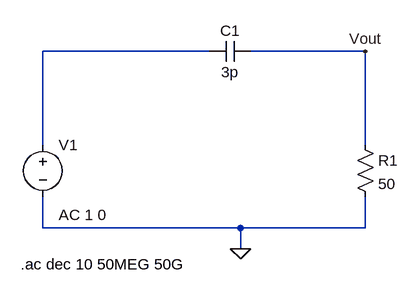
[diagram p0: schematic spice_example.asc]
spice_example.asc, the LTspice schematic file:
Version 4
SHEET 1 880 680
WIRE 240 -16 -16 -16
WIRE 480 -16 304 -16
WIRE -16 128 -16 -16
WIRE 480 128 480 -16
WIRE -16 256 -16 208
WIRE 288 256 -16 256
WIRE 480 256 480 208
WIRE 480 256 288 256
WIRE 288 288 288 256
FLAG 288 288 0
FLAG 480 -16 Vout
SYMBOL voltage -16 112 R0
WINDOW 3 24 96 Invisible 2
WINDOW 123 24 124 Left 2
WINDOW 39 0 0 Left 0
SYMATTR InstName V1
SYMATTR Value 0
SYMATTR Value2 AC 1 0
SYMBOL cap 304 -32 R90
WINDOW 0 0 32 VBottom 2
WINDOW 3 32 32 VTop 2
SYMATTR InstName C1
SYMATTR Value 3p
SYMBOL res 464 112 R0
SYMATTR InstName R1
SYMATTR Value 50
TEXT -50 312 Left 2 !.ac dec 10 50MEG 50G

The netlist it stands for:
* spice_example.asc
V1 N001 0 0 AC 1 0
C1 Vout N001 3p
R1 Vout 0 50
.ac dec 10 50MEG 50G
.backanno
.end

* Results of the author's LTspice run, read from the files saved beside the schematic
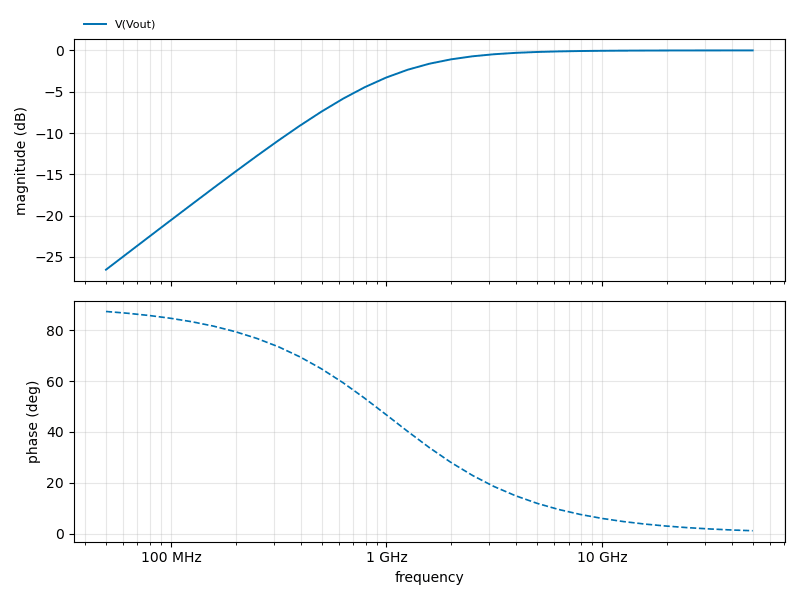
[diagram p1: AC Analysis of spice_example.asc, plotted from the saved traces]
* AC Analysis, 1 run:
*   V(Vout): -26.54 dB at 50 MHz, -0.00 dB at 50 GHz, peak -0.00 dB at 50 GHz, 3 dB below the peak at 1.066 GHz